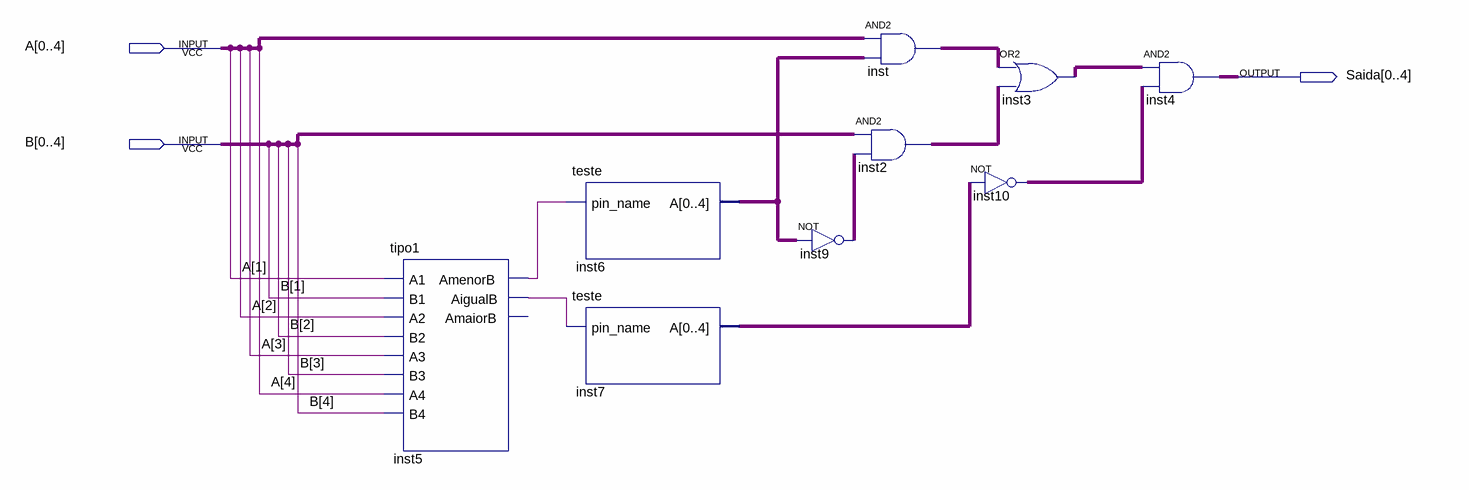
[diagram p0: schematic sheet]
// Quartus schematic selecionador_menor.bdf as structural Verilog: 9 symbols, 3 pins
module selecionador_menor (
  input  [0:4] A,
  input  [0:4] B,
  output [0:4] Saida
);

  wire inst5_aigualb, inst5_amenorb;
  wire [4:0] inst2_out, inst3_out, inst6_a, inst7_a, inst9_out, inst10_out, inst_out;

  tipo1 inst5 (
    .A1(A[1]), .B1(B[1]), .A2(A[2]), .B2(B[2]), .A3(A[3]), .B3(B[3]), .A4(A[4]), .B4(B[4]),
    .AmenorB(inst5_amenorb), .AigualB(inst5_aigualb));  // open: AmaiorB
  teste inst6 (.pin_name(inst5_amenorb), .A(inst6_a));
  teste inst7 (.pin_name(inst5_aigualb), .A(inst7_a));
  assign inst2_out = B & inst9_out;  // AND2 inst2, 5 bits wide
  assign inst9_out = ~inst6_a;  // NOT inst9, 5 bits wide
  assign inst_out = A & inst6_a;  // AND2 inst, 5 bits wide
  assign inst3_out = inst_out | inst2_out;  // OR2 inst3, 5 bits wide
  assign inst10_out = ~inst7_a;  // NOT inst10, 5 bits wide
  assign Saida = inst3_out & inst10_out;  // AND2 inst4, 5 bits wide
endmodule
